# EAGLE design PIC24fj64GAB002 (EAGLE 5.07)
LEFT: DCIN; LICENSE: CC-0; PROJECT: PIC24FJ64GB002; RIGHT: USB
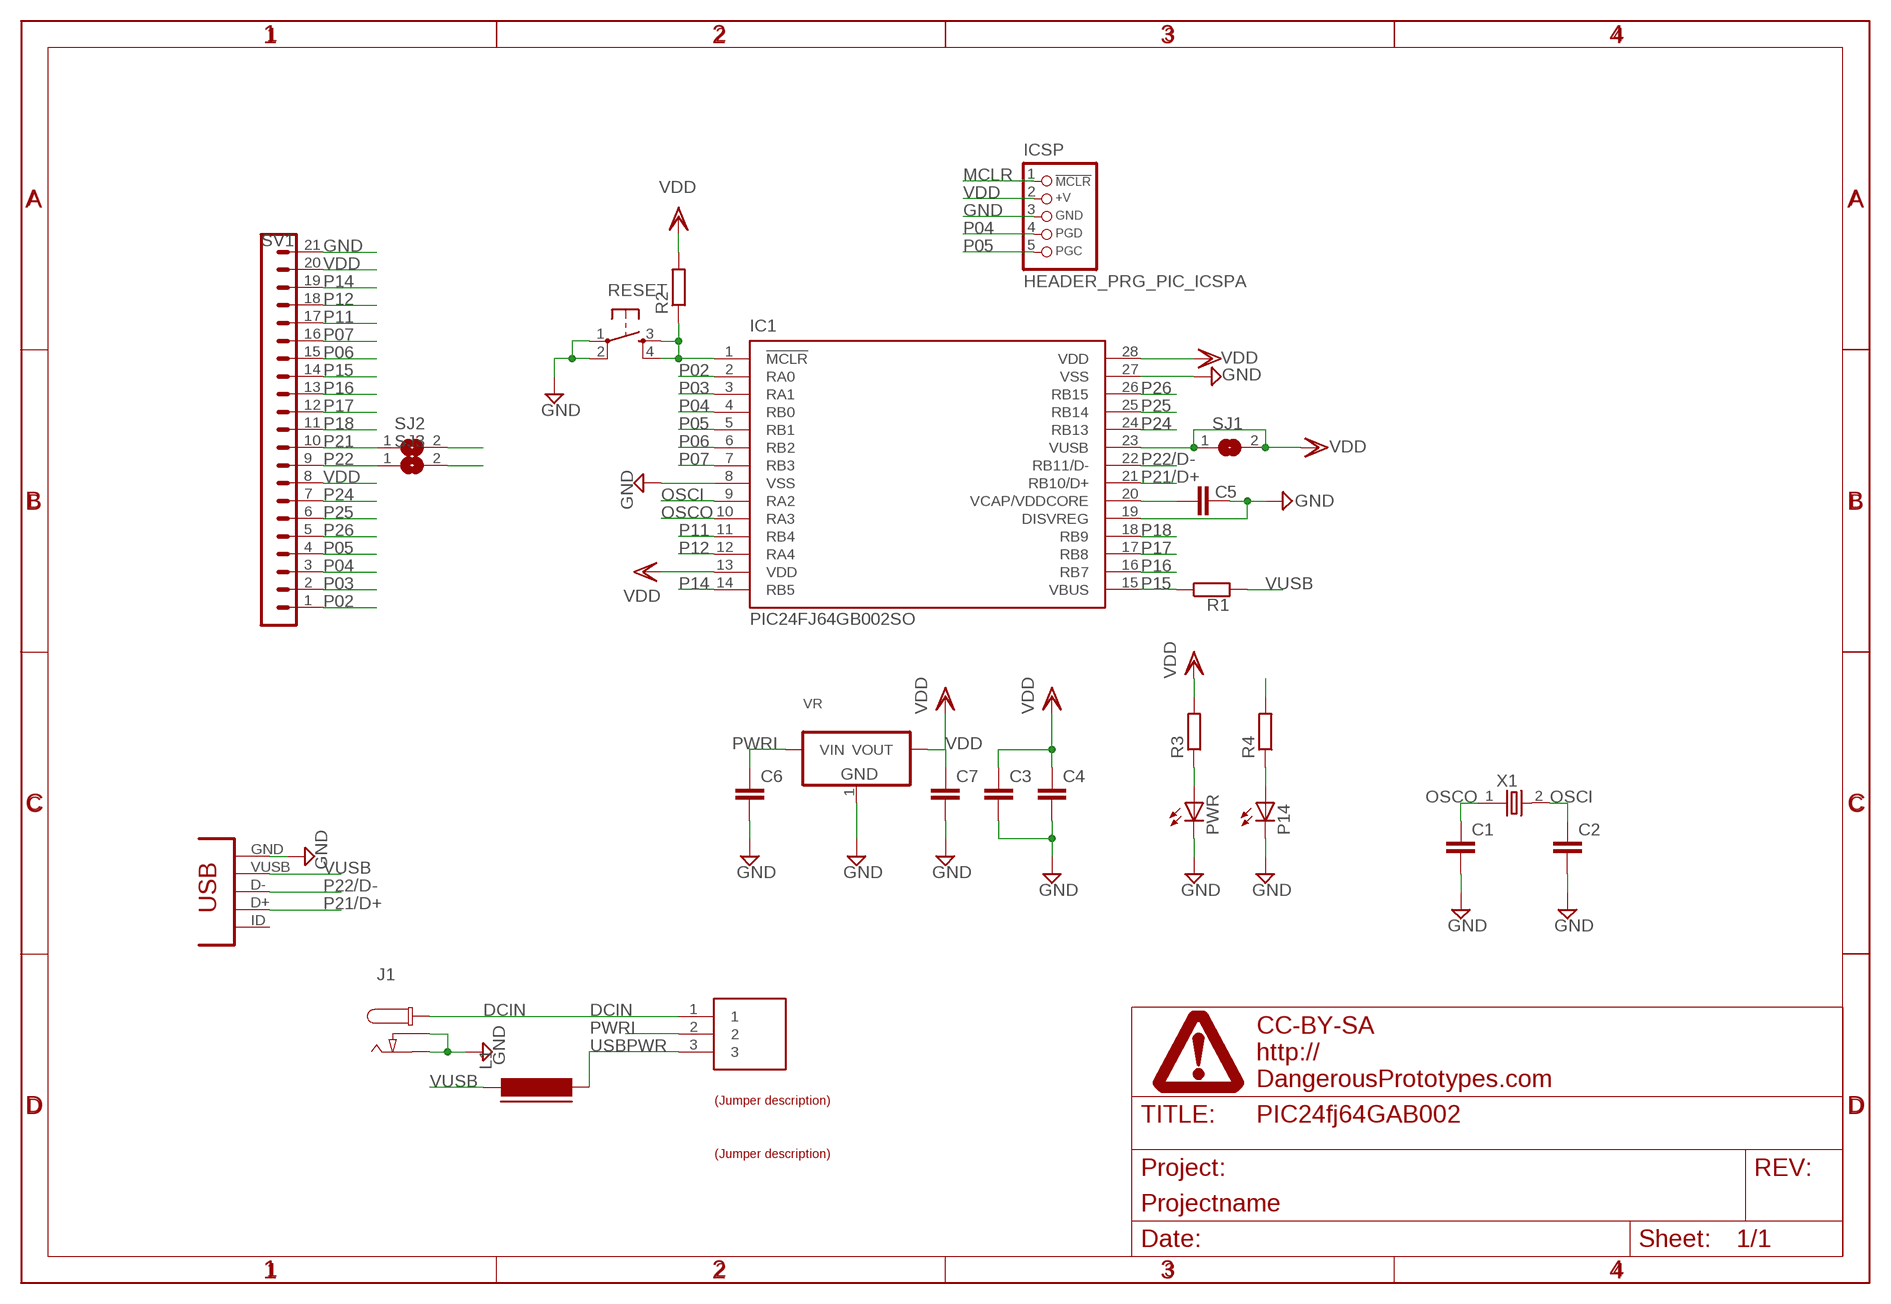
[diagram p0: schematic, sheet 1]

## Parts
C1  CAPC603  [C603]
C2  CAPC603  [C603]
C3  CAPC603  [C603]
C4  CAPC603  [C603]
C5  CAPC603  [C603]
C6  CAPC603  [C603]
C7  CAPC603  [C603]
IC1  PIC24FJ64GB002SO  [SOIC28W]
ICSP  HEADER_PRG_PIC_ICSPA  [HEADER_PRG_1X05]
J1  DC_BARREL_JACK-SMD  [DC_BARREL_JACK_SMD_2MM]
L1  FERRITE_BEAD603  [FB603]
P14  LED805  [LED-805]
PWR  LED805  [LED-805]
R1  RESISTORR603  [R603]
R2  RESISTORR603  [R603]
R3  RESISTORR603  [R603]
R4  RESISTORR603  [R603]
RESET  SW-SMD-SMALL  [TACT_SWITCH_SMALL]
SJ1  SJ  [SJ]
SJ2  SJ  [SJ]
SJ3  SJ  [SJ]
SV1  MA20-1  [MA20-1]
U$1  DINA4_L  [DP_LOGO]
U$3  HEADER1X3PTH  [M1X3]
U$4  JUMP3_DESC  [JUMP3_DESC@1]
U$6  LABEL_JUMPER_1X3  [JUMP3_DESC]
USB1  CON-USB-MINI-BUSB1  [CONN_USB_MINI-B]
VR  LD1117-3.3SOT223  [SOT223]
X1  OSC-XTAL  [HC-49U]

## Nets
DCIN: J1.P1@2(P1) U$3.1
GND: C1.2 C2.2 C3.2 C4.2 C5.2 C6.2 C7.2 IC1.8(VSS) IC1.19(DISVREG) IC1.27(VSS) ICSP.3(GND) J1.P2 J1.P3 P14.C PWR.C RESET.1 RESET.2 SV1.21 USB1.GND VR.1(GND)
MCLR: IC1.1(!MCLR) ICSP.1(/MCLR) R2.1 RESET.3 RESET.4
N$1: P14.A R4.1
N$2: PWR.A R3.1
N$4: C5.1 IC1.20(VCAP/VDDCORE)
OSCI: C2.1 IC1.9(RA2) X1.2
OSCO: C1.1 IC1.10(RA3) X1.1
P02: IC1.2(RA0) SV1.1
P03: IC1.3(RA1) SV1.2
P04: IC1.4(RB0) ICSP.4(PGD) SV1.3
P05: IC1.5(RB1) ICSP.5(PGC) SV1.4
P06: IC1.6(RB2) SV1.15
P07: IC1.7(RB3) SV1.16
P11: IC1.11(RB4) SV1.17
P12: IC1.12(RA4) SV1.18
P14: IC1.14(RB5) R4.2 SV1.19
P15: IC1.15(VBUS) R1.1 SV1.14
P16: IC1.16(RB7) SV1.13
P17: IC1.17(RB8) SV1.12
P18: IC1.18(RB9) SV1.11
P21: SJ2.1 SV1.10
P21/D+: IC1.21(RB10/D+) SJ2.2 USB1.D+
P22: SJ3.1 SV1.9
P22/D-: IC1.22(RB11/D-) SJ3.2 USB1.D-
P24: IC1.24(RB13) SV1.7
P25: IC1.25(RB14) SV1.6
P26: IC1.26(RB15) SV1.5
PWRI: C6.1 U$3.2 VR.3(VIN)
USBPWR: L1.2 U$3.3
VDD: C3.1 C4.1 C7.1 IC1.13(VDD) IC1.23(VUSB) IC1.28(VDD) ICSP.2(+V) R2.2 R3.2 SJ1.1 SJ1.2 SV1.8 SV1.20 VR.2(VOUT)
VUSB: L1.1 R1.2 USB1.VUSB
Unconnected: USB1.BODY@1(BODY) USB1.BODY@2(BODY) USB1.BODY@3(BODY) USB1.BODY@4(BODY) USB1.ID(USBID)

## Library data of the parts
C1-C7 = dp_devices:CAP
IC1 = dp_devices:PIC24FJ64GB002: PIC24FJ64GA002 edit this description Auto generated by make-symbol-device-package-bsdl.ulp Rev. 25 Source: PIC24FJ64GA002.bsd
ICSP = dp_devices:HEADER_PRG_PIC_ICSP: 5-pin PIC In Circuit Serial Programming header
J1 = dp_devices:DC_BARREL_JACK: DC power connector
L1 = dp_devices:FERRITE_BEAD
P14 PWR = dp_devices:LED
R1-R4 = dp_devices:RESISTOR
RESET = dp_devices:SW-SMD-SMALL
SJ1-SJ3 = jumper:SJ: SMD solder JUMPER
SV1 = con-lstb:MA20-1: PIN HEADER; OC_FARNELL: unknown; OC_NEWARK: unknown
U$1 = dp_devices:DINA4_L: A4 DP frame Standard Dangerous Prototypes schematic frame. Automagically adds the DP logo and standard texts to the PCB Use the atrribute in the schematic editor to change the fields.; FF1: fulfillment by; FF2: Seeed Studio; FF3: www.seeedstudio.com; LICENSE: CC-BY-SA; PROJECT: Projectname; URL1: http://; URL2: DangerousPrototypes.com
U$3 = dp_devices:HEADER1X3
U$4 = dp_devices:JUMP3_DESC: Nice formatted three legged jumperdescription Use attributes to change the values LEFT = With jumper to the left RIGHT = With jumper to the right; LEFT: left; RIGHT: right
U$6 = dp_devices:LABEL_JUMPER_1X3: Nice formatted three legged jumperdescription Use attributes to change the values LEFT = With jumper to the left RIGHT = With jumper to the right; LEFT: left; RIGHT: right
USB1 = dp_devices:CON-USB-MINI-B: USB connector
VR = dp_devices:LD1117-3.3
X1 = dp_devices:OSC-XTAL

## Board
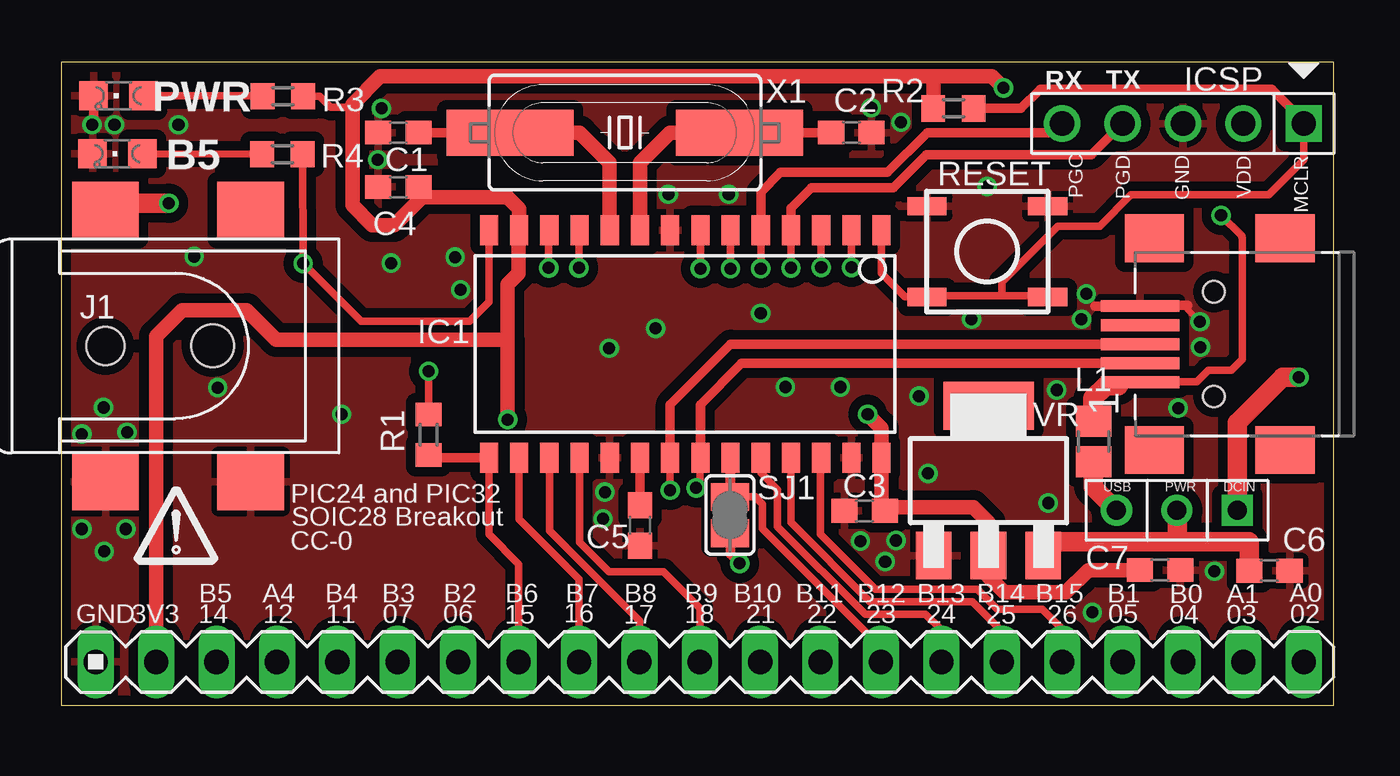
[diagram p1: board, top side]
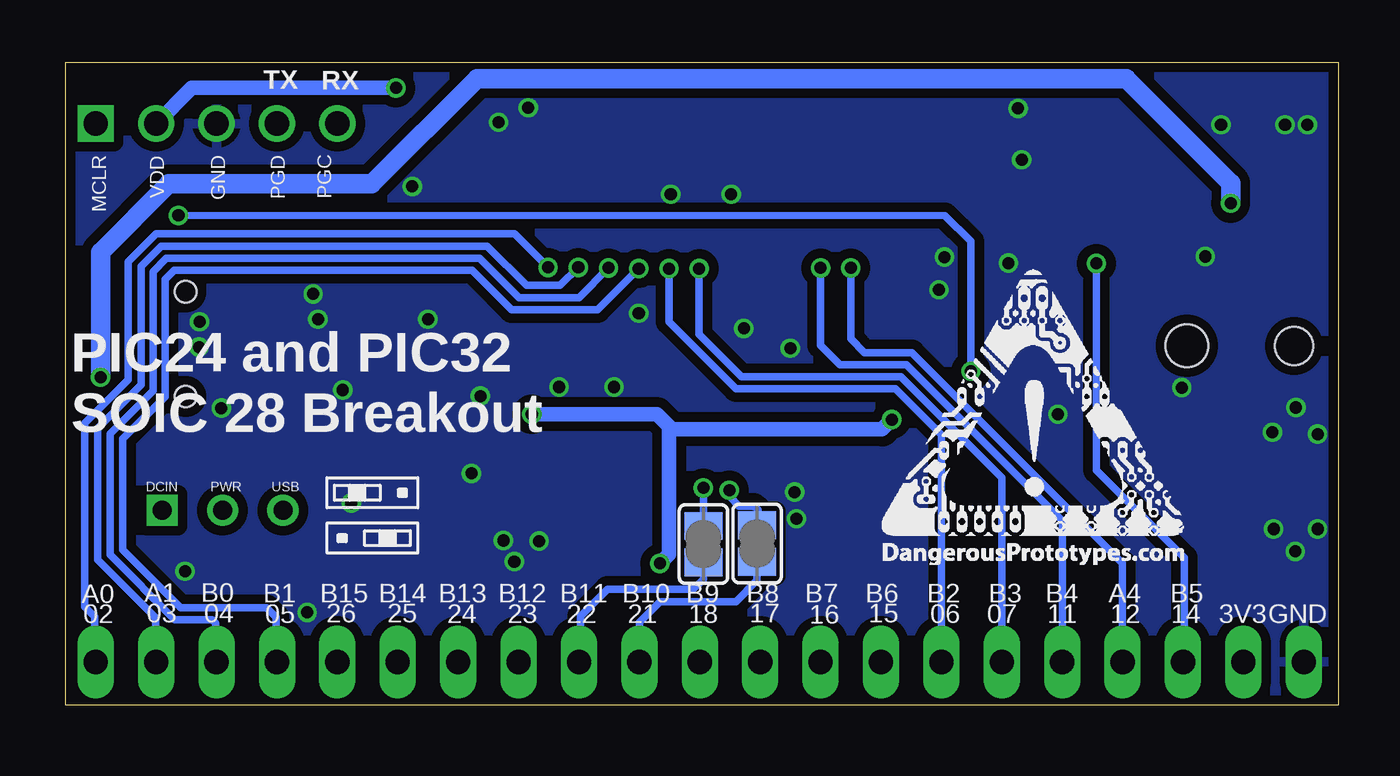
[diagram p2: board, bottom side, seen from below]

Size 53.52 x 27.02 mm. Coordinates in mm from the lower left corner, seen from the top.
Outline: 53.52,27.02 0,27.02 0,0 53.52,0 53.52,27.02
Copper layers (1*16): Top 0.035mm / dielectric 1.5mm / Bottom 0.035mm
Design rules "Fusion_eagle_rule_v1.1 *": minimum track width 6mil, minimum drill 12mil, track to track 8mil, track to pad 8mil, pad to pad 8mil, via to via 8mil, smd to smd 0mil, copper to edge 10mil, drill to drill 10mil, minimum pad ring 10mil, minimum via ring 6mil, stop-mask expansion 2mil, vias tented up to drill 100mil, thermal gap 10mil

### Footprints (pad centres in the part's own frame; a part is rotated, then mirrored left to right if it is on the bottom)
C603 = smd 1.1 x 1: 1 -0.85,0; 2 0.85,0
SOIC28W = smd 0.762 x 1.27: 1 -8.89,-4.78; 2 -7.62,-4.78; 3 -6.35,-4.78; 4 -5.08,-4.78; 5 -3.81,-4.78; 6 -2.54,-4.78; 7 -1.27,-4.78; 8 0,-4.78; 9 1.27,-4.78; 10 2.54,-4.78; 11 3.81,-4.78; 12 5.08,-4.78; 13 6.35,-4.78; 14 7.62,-4.78; 15 7.62,4.78; 16 6.35,4.78; 17 5.08,4.78; 18 3.81,4.78; 19 2.54,4.78; 20 1.27,4.78; 21 0,4.78; 22 -1.27,4.78; 23 -2.54,4.78; 24 -3.81,4.78; 25 -5.08,4.78; 26 -6.35,4.78; 27 -7.62,4.78; 28 -8.89,4.78
HEADER_PRG_1X05 = drill 1.016 square: 1 -5.08,0 | drill 1.016 round: 2 -2.54,0; 3 0,0; 4 2.54,0; 5 5.08,0
DC_BARREL_JACK_SMD_2MM = smd 2.4 x 2.8: P1@1 -5.7,3.875; P1@2 -5.7,-2.225; P2 5.7,-2.225; P3 5.7,3.875 | hole 1.8: 0,2.275 | hole 1.6: 0,-2.225
FB603 = smd 1.3 x 1.5: 1 -0.85,0; 2 0.85,0
LED-805 = smd 1.2 x 1.2: A 0,-1.05; C 0,1.05
R603 = smd 1 x 1.1: 1 -0.85,0; 2 0.85,0
TACT_SWITCH_SMALL = smd 1.651 x 0.762: 1 -2.54,1.905; 2 2.54,1.905; 3 -2.54,-1.905; 4 2.54,-1.905
SJ = smd 1.168 x 1.6: 1 -0.762,0; 2 0.762,0
MA20-1 = drill 1.016 long: 1 -24.13,0; 2 -21.59,0; 3 -19.05,0; 4 -16.51,0; 5 -13.97,0; 6 -11.43,0; 7 -8.89,0; 8 -6.35,0; 9 -3.81,0; 10 -1.27,0; 11 1.27,0; 12 3.81,0; 13 6.35,0; 14 8.89,0; 15 11.43,0; 16 13.97,0; 17 16.51,0; 18 19.05,0; 19 21.59,0; 20 24.13,0; 21 26.67,0
M1X3 = drill 0.8 square: 1 0,0 | drill 0.8 round: 2 2.54,0; 3 5.08,0
CONN_USB_MINI-B = smd 2 x 2.5: BODY@1 -4.45,2.5; BODY@2 4.45,2.5; BODY@3 4.45,-3; BODY@4 -4.45,-3 | smd 0.5 x 3.3: D+ 0,3.1; D- -0.8,3.1; GND 1.6,3.1; ID 0.8,3.1; VUSB -1.6,3.1 | hole 0.9: -2.2,0; 2.2,0
SOT223 = smd 1.5 x 2: 1 -2.3,-3.15; 2 0,-3.15; 3 2.3,-3.15 | smd 3.8 x 2: 4 0,3.15
HC-49U = smd 5.334 x 1.93: 1 -4.826,0; 2 4.826,0

### Placement (x,y rotation side)
C1  14.17,24.07 180 top
C2  33.22,24.07 0 top
C3  33.78,8.17 180 top
C4  14.17,21.78 180 top
C5  24.33,7.56 270 top
C6  50.8,5.65 0 top
C7  46.2,5.68 0 top
IC1  25.6,15.18 180 top
ICSP  47.17,24.45 180 top
J1  4.09,15.1 270 top
L1  43.41,11.09 270 top
P14  2.36,23.18 90 top
PWR  2.41,25.62 90 top
R1  15.44,11.37 90 top
R2  37.52,25.09 180 top
R3  9.32,25.59 0 top
R4  9.3,23.15 0 top
RESET  38.94,19.07 0 top
SJ1  28.12,7.99 270 top
SJ2  24.44,6.8 90 bottom
SJ3  26.7,6.77 90 bottom
SV1  28.12,1.82 180 top
U$1  4.83,6.54 0 top
U$2  [DP_LOGO_ART_0.5X0.5]  19.18,5.91 0 bottom
U$3  49.45,8.19 180 top
U$4  JUMP3_DESC  [JUMP3_DESC]  37.44,7.66 0 bottom
USB1  48.46,15.18 90 top
VR  38.99,9.44 0 top
X1  23.7,24.07 0 top

### Tracks (layer width: path | path; a pad name or v marks a point on that pad's centre or on a via)
DCIN  (via drill 0.51)
  Top 0.813: J1.P1@2 2.01,21.1 v4.52,21.1 | v52.04,13.78 51.36,13.78 49.45,11.88 U$3.1
  Bottom 0.813: v4.52,21.1 4.52,21.94 8.92,26.33 36.22,26.33 40.64,21.91 49.17,21.91 52.04,19.04 v52.04,13.78
GND  (via drill 0.51)
  Top 0.254: 47.37,16.8 47.37,16.63 v47.88,16.12
  Top 0.406: 43.89,16.78 43.46,16.78 | 47.37,16.8 46.89,16.8 | 1.4,24.6 1.37,24.63 1.37,25.61 PWR.C
  other vias: 47.9,15.05 42.9,16.22 38.28,16.22 41.5,8.5 22.86,8.96 38.94,21.81 35.31,24.5 34.06,25.11 13.31,22.93 43.36,3.9 48.49,5.63 24.99,15.84 32.77,13.38 23.04,15 41.86,13.25 46.96,12.49 13.87,18.58 16.56,18.84 16.79,17.47 30.45,13.38 36.07,12.99 36.45,9.74 33.6,6.9 35.1,6.92 34.65,6.04 28.07,21.48 25.53,21.48 5.59,18.86 6.58,13.35 11.79,12.23 43.1,17.29 29.41,16.47 13.46,25.09 2.24,24.4 1.3,24.4 4.93,24.4 22.78,7.84 1.78,12.51 2.77,11.47 0.86,11.39 0.86,7.41 2.72,7.41 1.8,6.47
  pour Top (isolate 0.406): 53.52,27.04 -1.09,27.04 -1.07,-0.06 53.54,-0.06
  pour Bottom (isolate 0.406): 53.52,27.04 -1.09,27.04 -1.07,-0.06 53.54,-0.06
MCLR
  Top 0.305: 39.55,17.21 39.55,17.77 41.91,20.13 43.66,20.13 44.98,21.45 50.77,21.45 52.25,22.93 ICSP.1 | 39.55,17.21 42.04,17.21 RESET.4 | 39.55,17.21 37.06,17.21 RESET.3 35.48,17.16 34.49,18.15 IC1.1
  Top 0.406: R2.1 40.36,25.08 41.17,25.9 50.9,25.9 52.25,24.55 ICSP.1
N$1
  Top 0.305: P14.A R4.1
N$2
  Top 0.305: PWR.A 8.45,25.62 R3.1
N$4
  Top 0.406: C5.1 IC1.20
OSCI
  Top 0.406: 29.41,24.07 C2.1
  Top 0.61: IC1.9 24.33,22.8 25.6,24.07 X1.2 29.41,24.07
OSCO
  Top 0.406: C1.1 X1.1
  Top 0.61: IC1.10 23.06,22.8 21.79,24.07 X1.1
P02  (via drill 0.51)
  Top 0.305: v33.22,18.4 IC1.2
  Bottom 0.305: SV1.1 52.3,1.87 52.3,3.72 52.71,4.13 52.71,11.85 50.88,13.68 50.88,18.64 49.71,19.81 34.63,19.81 v33.22,18.4
P03  (via drill 0.51)
  Top 0.305: v31.95,18.4 IC1.3 31.95,20.26
  Bottom 0.305: v31.95,18.4 32.72,17.64 34.14,17.64 35.79,19.3 49.49,19.3 50.34,18.45 50.34,13.48 52.17,11.65 52.17,6.11 49.73,3.67 49.73,1.84 SV1.2
P04  (via drill 0.51)
  Top 0.305: v30.68,18.38 30.68,19.42
  Top 0.406: 30.68,19.42 IC1.4 30.68,20.89 31.55,21.76 35,21.76 36.37,23.13 43.31,23.13 ICSP.4
  Bottom 0.305: SV1.3 47.19,1.84 47.19,3.44 47.35,3.6 48.92,3.6 51.64,6.31 51.64,11.42 49.84,13.22 49.84,18.23 49.27,18.79 36.1,18.79 34.44,17.13 31.93,17.13 v30.68,18.38
P05  (via drill 0.51)
  Top 0.305: v29.41,18.35 IC1.5
  Top 0.406: IC1.5 29.41,21.55 30.25,22.39 34.75,22.39 36.42,24.07 41.71,24.07 ICSP.5
  Bottom 0.305: SV1.4 44.65,1.84 44.65,3.7 45.06,4.1 48.67,4.1 51.11,6.54 51.11,11.19 49.33,12.97 49.33,17.9 48.95,18.28 36.42,18.28 34.77,16.62 31.15,16.62 v29.41,18.35
P06  (via drill 0.51)
  Top 0.305: v28.14,18.35 IC1.6
  Bottom 0.305: v28.14,18.35 28.14,16.12 25.32,13.3 18.62,13.3 16.69,11.37 SV1.15
P07  (via drill 0.51)
  Top 0.305: v26.87,18.35 IC1.7
  Bottom 0.305: v26.87,18.35 26.87,15.59 25.1,13.81 18.39,13.81 14.15,9.57 SV1.16
P11  (via drill 0.51)
  Top 0.305: IC1.11 21.77,19.93 v21.77,18.38
  Bottom 0.305: v21.77,18.38 21.77,15.13 20.96,14.32 18.16,14.32 11.61,7.76 SV1.17
P12  (via drill 0.51)
  Top 0.305: IC1.12 20.5,19.93 v20.5,18.38
  Bottom 0.305: v20.5,18.38 20.5,15.41 19.91,14.82 17.93,14.82 9.07,5.96 SV1.18
P14  (via drill 0.51)
  Top 0.305: IC1.14 17.98,16.96 17.17,16.14 12.6,16.14 v10.17,18.57 R4.2
  Bottom 0.305: v10.17,18.57 10.17,9.88 6.48,6.19 6.48,1.87 SV1.19
P15
  Top 0.305: IC1.15 17.98,7.18 19.23,5.93 SV1.14
  Top 0.406: IC1.15 15.56,10.4 R1.1
P16
  Top 0.305: SV1.13 21.77,5.3 19.25,7.81 IC1.16
P17
  Top 0.305: SV1.12 24.31,3.55 20.52,7.33 IC1.17
P18
  Top 0.305: IC1.18 21.79,6.85 23.04,5.6 25.32,5.6 26.85,4.08 SV1.11
P21
  Bottom 0.305: SJ2.1 24.44,5.25 25.32,4.36 28.52,4.36 29.39,3.49 SV1.10
P21/D+  (via drill 0.51)
  Top 0.305: v25.6,9.03 IC1.21
  Top 0.406: USB1.D+ 28.14,15.18 25.6,12.64 IC1.21
  Bottom 0.305: v25.6,9.03 25.6,8.75 25.58,8.75 25.2,8.37 24.56,8.37 24.41,8.22 24.41,7.58 SJ2.2
P22
  Bottom 0.305: SJ3.1 26.7,5.3 27.13,4.87 30.73,4.87 31.85,3.75 31.85,1.89 SV1.9
P22/D-  (via drill 0.51)
  Top 0.305: IC1.22 26.85,10.38 26.85,9.29 v26.7,9.13
  Top 0.406: USB1.D- 28.61,14.38 26.87,12.64 IC1.22
  Bottom 0.305: SJ3.2 v26.7,9.13
P24
  Top 0.305: IC1.24 29.41,9.77 30.12,9.06 30.12,7.51 33.81,3.83 36.35,3.83 37.01,3.16 SV1.7
P25
  Top 0.305: 30.68,10.43 IC1.25 30.68,7.69 34.01,4.36 38.3,4.36 39.55,3.11 SV1.6
P26
  Top 0.305: IC1.26 31.93,10.43 31.93,7.18 34.24,4.87 38.53,4.87 39.37,4.03 41.25,4.03 42.11,3.16 42.09,3.14 SV1.5
PWRI
  Top 0.813: VR.3 41.87,6.87 46.94,6.87 | 46.94,6.87 49.94,6.87 49.95,6.86 C6.1 | U$3.2 46.94,8.17 46.94,6.87
USBPWR
  Top 0.813: L1.2 43.41,9.16 U$3.3
VDD  (via drill 0.51)
  Top 0.305: 43.46,5.68 43.38,5.6 | SV1.8 34.47,2.43 29.49,7.41 29.49,8.45 29.18,8.75 SJ1.1 | R3.2 10.87,25.59 11.33,25.14 12.22,25.14 12.24,25.11
  Top 0.406: v28.52,5.96 28.14,6.34 28.14,7.2 SJ1.2 SJ1.1 | 19.23,19.93 IC1.13 | 36.68,26.43 36.67,26.42 | 34.49,8.18 C3.1 | SJ1.1 28.14,8.78 IC1.23 28.12,10.4 SJ1.1
  Top 0.61: IC1.13 19.25,20.87 18.77,21.35 15.16,21.35 | C7.1 43.46,5.68 43.18,5.68 42.24,4.74 39.65,4.74 38.99,5.4 VR.2 38.99,7.69 38.35,8.32 34.56,8.32 C3.1 | v33.91,12.23 34.49,11.65 IC1.28 34.49,8.18 | 18.77,15.36 v18.77,12 | 18.77,15.36 18.77,17.69 19.23,18.15 19.23,19.93 | v39.62,25.95 39.14,26.43 36.68,26.43 13.41,26.43 12.24,25.26 12.24,25.11 12.24,21.02 13.08,20.18 14,20.18 15.16,21.35 | 36.67,26.42 R2.2 | SV1.20 3.99,15.51 5.08,16.6 7.8,16.6 9.04,15.36 18.77,15.36 | 15.16,21.35 15.16,21.64 C4.1
  Bottom 0.61: v33.91,12.23 28.65,12.23 28.14,11.72 28.14,11.6 | v28.52,5.96 28.14,6.34 28.14,11.6 | ICSP.2 48.21,25.95 v39.62,25.95 | v18.77,12 19.18,11.6 28.14,11.6
VUSB  (via drill 0.51)
  Top 0.254: 44.45,13.43 44.63,13.43 44.78,13.58 USB1.VUSB | USB1.VUSB | 43.54,12.89 43.38,12.89
  Top 0.305: 43.54,12.89 44.25,13.6 47.75,13.6 48.23,14.09 49.2,14.09 49.66,14.54 49.66,19.65 49.63,19.67 49.63,19.73 v48.77,20.59 | R1.2 v15.44,14.04
  Top 0.813: 44.45,13.43 43.92,13.43 43.38,12.89 43.38,11.96 L1.1
  Bottom 0.305: v48.77,20.59 16.54,20.56 15.44,19.5 v15.44,14.04

### Text on the board
tNames: RX | TX | PGC | PGD | GND | VDD | MCLR | B5 | USB | PWR | DCIN | PIC24 and PIC32 | SOIC28 Breakout | CC-0 | B5 | A4 | B4 | B3 | B2 | B6 | B7 | B8 | B9 | B10 | B11 | B12 | B13 | B14 | B15 | B1 | B0 | A1 | A0 | GND | 3V3 | 14 | 12 | 11 | 07 | 06 | 15 | 16 | 17 | 18 | 21 | 22 | 23 | 24 | 25 | 26 | 05 | 04 | 03 | 02
bNames: RX | TX | PGC | PGD | GND | VDD | MCLR | PIC24 and PIC32 | SOIC 28 Breakout | USB | PWR | DCIN | A4 | B4 | B3 | B2 | B6 | B7 | B8 | B9 | B10 | B11 | B12 | B13 | B14 | B15 | B1 | B0 | A1 | A0 | GND | B5 | 12 | 11 | 07 | 06 | 15 | 16 | 17 | 18 | 21 | 22 | 23 | 24 | 25 | 26 | 05 | 04 | 03 | 02 | 3V3 | 14